# Altium schematic sheet Oscillator.SchDoc
size A; SheetNumber: 4; SheetTotal: 10
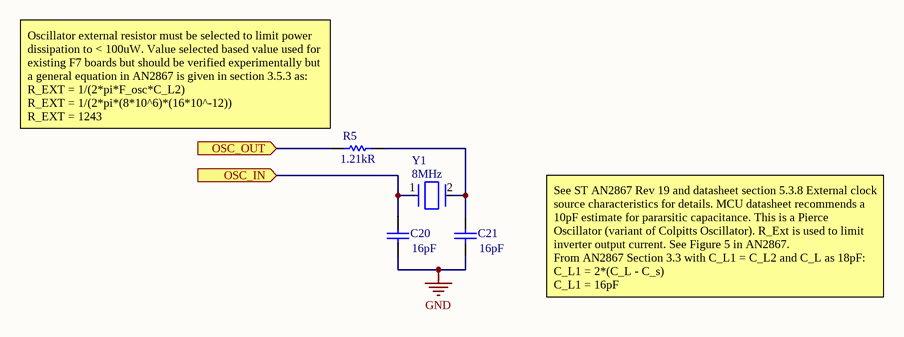
[diagram p0: Oscillator.SchDoc]

## Parts
C20  Capacitance: 16pF  [CAPC1608X90X35ML15T15]  (hidden comment: 06035A160JAT2A)
C21  Capacitance: 16pF  [CAPC1608X90X35ML15T15]  (hidden comment: 06035A160JAT2A)
R5  Resistance: 1.21kR  [RESC1005X40X25NL10T10]  (hidden comment: CR0402-FX-1211GLF)
Y1  Frequency: 8MHz  [FP-ABM3-MFG]  (hidden comment: ABM3-8.000MHZ-D2Y-T)

## Ports
OSC_IN (in, see TCU[4B], Processor[3B]), OSC_OUT (in, see TCU[4B], Processor[3B])

## Nets
GND: C20.1 C21.1
OSC_IN: C20.2 Y1.1 ; port OSC_IN
OSC_OUT: R5.1 ; port OSC_OUT
NetC21_2: C21.2 R5.2 Y1.2

## Notes on the sheet
- (near R5) Oscillator external resistor must be selected to limit power dissipation to < 100uW. Value selected based value used for existing F7 boards but should be verified experimentally but a general equation in AN2867 is given in section 3.5.3 as:
  R_EXT = 1/(2*pi*F_osc*C_L2)
  R_EXT = 1/(2*pi*(8*10^6)*(16*10^-12))
  R_EXT = 1243
- See ST AN2867 Rev 19 and datasheet section 5.3.8 External clock source characteristics for details. MCU datasheet recommends a 10pF estimate for pararsitic capacitance. This is a Pierce Oscillator (variant of Colpitts Oscillator). R_Ext is used to limit inverter output current. See Figure 5 in AN2867.
  From AN2867 Section 3.3 with C_L1 = C_L2 and C_L as 18pF:
  C_L1 = 2*(C_L - C_s)
  C_L1 = 16pF

## Library data of the parts
C20 C21 = CMP-2006-04247-1: Manufacturer: AVX Interconnect / Elco; Part Number: 06035A160JAT2A
R5 = CMP-2002-04749-1: Manufacturer: Bourns; Part Number: CR0402-FX-1211GLF
Y1 = CMP-2000-05033-2: Crystal 8MHz ±20ppm 18pF SMD-2 5mm x 3.2mm; Series Resistance: 500R; Frequency Stability: 30ppm; ESR (Equivalent Series Resistance): 140R; Load Capacitance: 18pF; Height: 0.051inch; Tolerance: 20ppm; Depth: 3.2mm; Max Operating Temperature: 85°C; Termination: SMD/SMT; Lead Free: Lead Free; Number of Pins: 2; Width: 3.2mm; RoHS Compliant: Yes; Resistor Type: Ceramic; Length: 5mm; Mount: Surface Mount; Case/Package: CSMD; Package Quantity: 1000; Radiation Hardening: No; Min Operating Temperature: -40°C; Packaging: Tape and Reel; Frequency Tolerance: 20ppm